# Altium schematic sheet TestComponents.SchDoc
size A
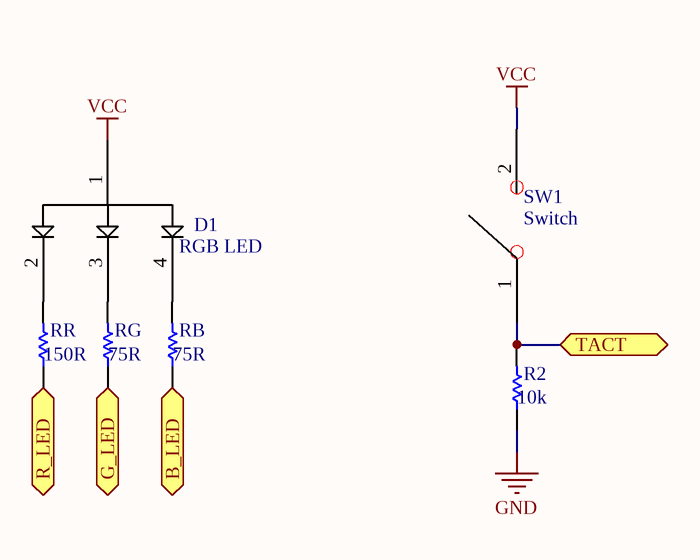
[diagram p0: TestComponents.SchDoc]

## Parts
D1  RGB LED  [RGB_LED]
R2  value 10k  [6-0805_N]  (hidden comment: Res1)
RB  value 75R  [6-0805_N]  (hidden comment: Res1)
RG  value 75R  [6-0805_N]  (hidden comment: Res1)
RR  value 150R  [6-0805_N]  (hidden comment: Res1)
SW1  Switch  [TACT_SWITCH]

## Ports
B_LED, G_LED, R_LED, TACT

## Nets
1: SW1.2
3: SW1.4
GND: R2.1
VCC: D1.1(AN) SW1.2
B_LED: RB.1 ; port B_LED
G_LED: RG.1 ; port G_LED
R_LED: RR.1 ; port R_LED
TACT: R2.2 SW1.1 ; port TACT
NetD1_2: D1.2(R) RR.2
NetD1_3: D1.3(G) RG.2
NetD1_4: D1.4(B) RB.2

## Library data of the parts
R2 RB RG RR = Res1: Resistor; Published: 8-Jun-2000; LatestRevisionDate: 17-Jul-2002; LatestRevisionNote: Re-released for DXP Platform.; PackageReference: AXIAL-0.3; Publisher: Altium Limited; PackageDescription: Axial Device, Thru-Hole; 2 Leads; 0.3 in Pin Spacing